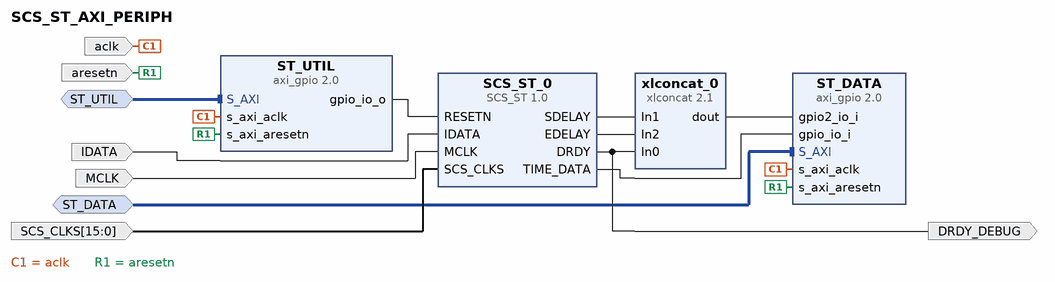
[diagram p0: block diagram of the top level]
# Vivado block design SCS_ST_AXI_PERIPH, xc7z020clg400-1, Vivado 2019.1
create_bd_design SCS_ST_AXI_PERIPH

create_bd_intf_port -mode Slave -vlnv xilinx.com:interface:aximm_tlm:1.0 ST_DATA
create_bd_intf_port -mode Slave -vlnv xilinx.com:interface:aximm_tlm:1.0 ST_UTIL
create_bd_port -dir I -type data IDATA
create_bd_port -dir I MCLK
create_bd_port -dir I -from 15 -to 0 -type clk SCS_CLKS
set_property -dict {CONFIG.FREQ_HZ 460000000} [get_bd_ports SCS_CLKS]
create_bd_port -dir I -type clk aclk
set_property -dict {CONFIG.FREQ_HZ 100000000} [get_bd_ports aclk]
create_bd_port -dir I -type rst aresetn
create_bd_port -dir O -type data DRDY_DEBUG

create_bd_cell -type ip -vlnv xilinx.com:ip:axi_gpio:2.0 ST_DATA
set_property -dict [list \
  CONFIG.C_ALL_INPUTS 1 \
  CONFIG.C_ALL_INPUTS_2 1 \
  CONFIG.C_GPIO2_WIDTH 17 \
  CONFIG.C_IS_DUAL 1 \
] [get_bd_cells ST_DATA]
create_bd_cell -type ip -vlnv xilinx.com:ip:xlconcat:2.1 xlconcat_0
set_property -dict {CONFIG.IN0_WIDTH 1 CONFIG.IN1_WIDTH 8 CONFIG.IN2_WIDTH 8 CONFIG.NUM_PORTS 3} [get_bd_cells xlconcat_0]
create_bd_cell -type ip -vlnv xilinx.com:ip:axi_gpio:2.0 ST_UTIL
set_property -dict {CONFIG.C_ALL_OUTPUTS 1 CONFIG.C_GPIO_WIDTH 1} [get_bd_cells ST_UTIL]
create_bd_cell -type ip -vlnv cri.nz:user:SCS_ST:1.0 SCS_ST_0

# ---- connections ----

connect_bd_intf_net [get_bd_intf_ports ST_DATA] [get_bd_intf_pins ST_DATA/S_AXI]
connect_bd_intf_net -intf_net CT_DATA_1 [get_bd_intf_ports ST_UTIL] [get_bd_intf_pins ST_UTIL/S_AXI]
connect_bd_net [get_bd_ports IDATA] [get_bd_pins SCS_ST_0/IDATA]
connect_bd_net [get_bd_ports MCLK] [get_bd_pins SCS_ST_0/MCLK]
connect_bd_net [get_bd_ports SCS_CLKS] [get_bd_pins SCS_ST_0/SCS_CLKS]
connect_bd_net [get_bd_pins SCS_ST_0/DRDY] [get_bd_pins xlconcat_0/In0] [get_bd_ports DRDY_DEBUG]
connect_bd_net [get_bd_pins SCS_ST_0/SDELAY] [get_bd_pins xlconcat_0/In1]
connect_bd_net [get_bd_pins SCS_ST_0/EDELAY] [get_bd_pins xlconcat_0/In2]
connect_bd_net [get_bd_pins xlconcat_0/dout] [get_bd_pins ST_DATA/gpio2_io_i]
connect_bd_net [get_bd_pins SCS_ST_0/TIME_DATA] [get_bd_pins ST_DATA/gpio_io_i]
connect_bd_net -net axi_gpio_1_gpio_io_o [get_bd_pins ST_UTIL/gpio_io_o] [get_bd_pins SCS_ST_0/RESETN]
connect_bd_net [get_bd_ports aclk] [get_bd_pins ST_DATA/s_axi_aclk] [get_bd_pins ST_UTIL/s_axi_aclk]
connect_bd_net [get_bd_ports aresetn] [get_bd_pins ST_DATA/s_axi_aresetn] [get_bd_pins ST_UTIL/s_axi_aresetn]

validate_bd_design
save_bd_design
